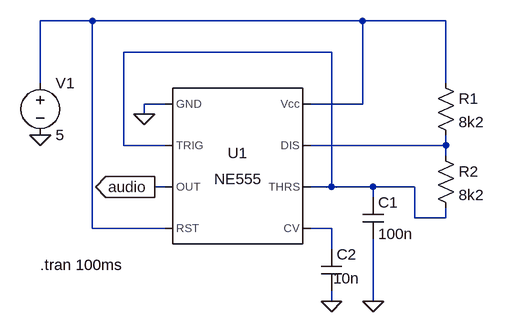
[diagram p0: schematic Draft2.asc]
Draft2.asc, the LTspice schematic file:
Version 4
SHEET 1 1012 680
WIRE 192 112 112 112
WIRE 608 112 192 112
WIRE 736 112 608 112
WIRE 560 160 240 160
WIRE 112 208 112 112
WIRE 736 208 736 112
WIRE 304 240 272 240
WIRE 608 240 608 112
WIRE 608 240 528 240
WIRE 272 256 272 240
WIRE 240 304 240 160
WIRE 304 304 240 304
WIRE 736 304 736 288
WIRE 736 304 528 304
WIRE 736 320 736 304
WIRE 304 368 288 368
WIRE 560 368 560 160
WIRE 560 368 528 368
WIRE 624 368 560 368
WIRE 688 368 624 368
WIRE 624 384 624 368
WIRE 688 416 688 368
WIRE 736 416 736 400
WIRE 736 416 688 416
WIRE 192 432 192 112
WIRE 304 432 192 432
WIRE 560 432 528 432
WIRE 560 464 560 432
WIRE 560 544 560 528
WIRE 624 544 624 448
FLAG 112 288 0
FLAG 560 544 0
FLAG 624 544 0
FLAG 288 368 audio
IOPIN 288 368 Out
FLAG 272 256 0
SYMBOL NE555 416 336 R0
SYMATTR InstName U1
SYMBOL Res 720 192 R0
SYMATTR InstName R1
SYMATTR Value 8k2
SYMBOL Res 720 304 R0
SYMATTR InstName R2
SYMATTR Value 8k2
SYMBOL Cap 608 384 R0
SYMATTR InstName C1
SYMATTR Value 100n
SYMBOL Voltage 112 192 R0
SYMATTR InstName V1
SYMATTR Value 5
SYMBOL Cap 544 464 R0
WINDOW 3 19 45 Left 2
SYMATTR InstName C2
SYMATTR Value 10n
TEXT 112 488 Left 2 !.tran 100ms

The netlist it stands for:
* Draft2.asc
XU1 0 N002 audio N001 N004 N002 N003 N001 NE555  ; pins GND TRIG OUT RST CV THRS DIS Vcc
R1 N001 N003 8k2
R2 N003 N002 8k2
C1 N002 0 100n
V1 N001 0 5
C2 N004 0 10n
.tran 100ms
.lib NE555.sub
.backanno
.end